# EAGLE design MRF49XA Breakout (EAGLE 6.4)
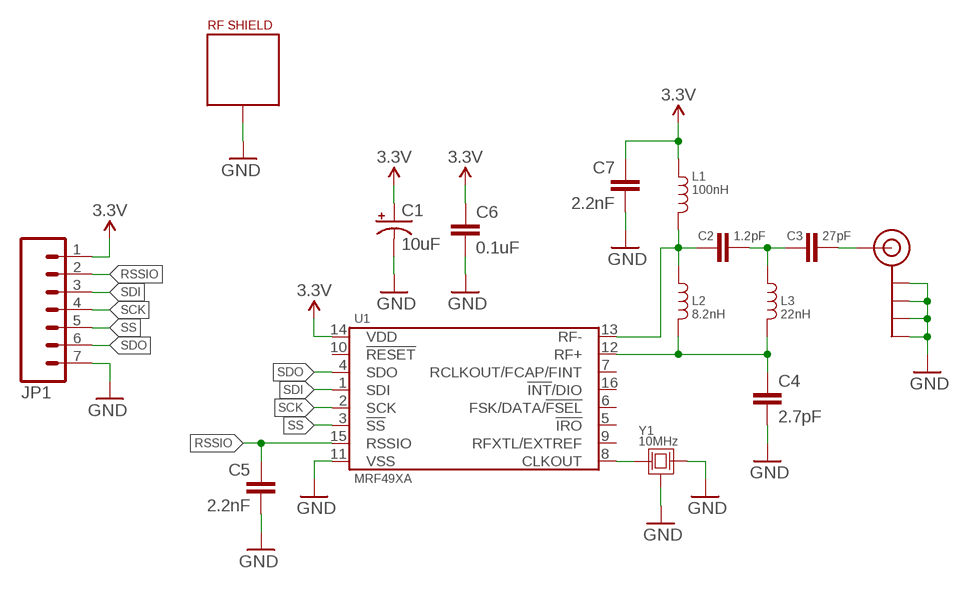
[diagram p0: schematic, sheet 1]

## Parts
C1  10uF  CAP_POL0805  [0805-CAP_POL]
C2  1.2pF  CAP0805  [0805]
C3  27pF  CAP0805  [0805]
C4  2.7pF  CAP0805  [0805]
C5  2.2nF  CAP0805  [0805]
C6  0.1uF  CAP0805  [0805]
C7  2.2nF  CAP0805  [0805]
J$1  SMA_EDGE  [SMA-EDGE]
JP1  M07  [1X07]
L1  100nH  INDUCTOR-0805  [0805]
L2  8.2nH  INDUCTOR-0805  [0805]
L3  22nH  INDUCTOR-0805  [0805]
U1  MRF49XA  [TSSOP-16]
U$1  RF-SHIELD  [RF_SHIELD-.65X.65]
Y1  10MHz  CRYSTAL-3.2X2.5  [FA-238]

## Nets
3.3V: C1.A(+) C6.1 C7.1 JP1.1 L1.1 U1.14(VDD)
GND: C1.C(-) C4.2 C5.2 C6.2 C7.2 J$1.GND@0(GND) J$1.GND@1(GND) J$1.GND@2(GND) J$1.GND@3(GND) JP1.7 U1.11(VSS) U$1.P$1 U$1.P$2 U$1.P$3 U$1.P$4 U$1.P$5 U$1.P$6 U$1.P$7 U$1.P$8 U$1.P$9 U$1.P$10 U$1.P$11 U$1.P$12 Y1.2(GND) Y1.3 Y1.4(GND)
N$1: C4.1 L2.2 L3.2 U1.12(RF+)
N$2: C2.1 L1.2 L2.1 U1.13(RF-)
N$3: C2.2 C3.1 L3.1
N$5: C3.2 J$1.SIG(SIGNAL)
N$12: U1.8(CLKOUT) Y1.1
RSSIO: C5.1 JP1.2 U1.15(RSSIO)
SCK: JP1.4 U1.2(SCK)
SDI: JP1.3 U1.1(SDI)
SDO: JP1.6 U1.4(SDO)
SS: JP1.5 U1.3(!SS)
Unconnected: U1.5(!IRO) U1.6(FSK/DATA/!FSEL) U1.7(RCLKOUT/FCAP/FINT) U1.9(RFXTL/EXTREF) U1.10(!RESET) U1.16(!INT!/DIO)

## Library data of the parts
C1 = SparkFun-Passives:CAP_POL: Capacitor Polarized These are standard SMD and PTH capacitors. Normally 10uF, 47uF, and 100uF in electrolytic and tantalum varieties. Always verify the external diameter of the through hole cap, it varies with capacity, voltage, and manufacturer. The EIA devices should be standard.
C2-C7 = SparkFun-Passives:CAP: Capacitor Standard 0603 ceramic capacitor, and 0.1" leaded capacitor.
J$1 = SparkFun-Connectors:SMA_EDGE: SMA Antenna Connector End launch SMA connector. The paste layer has been removed so that the connector can be hand soldered onto the board after reflow.
JP1 = SparkFun-Connectors:M07: Header 7 Standard 7-pin 0.1" header. Use with straight break away headers (SKU : PRT-00116), right angle break away headers (PRT-00553), swiss pins (PRT-00743), machine pins (PRT-00117), and female headers (PRT-00115). NOTES ON THE VARIANTS LOCK and LOCK_LONGPADS... This footprint was designed to help hold the alignment of a through-hole component (i.e. 7-pin header) while soldering it into place. You may notice that each hole has been shifted either up or down by 0.005 of an inch from it's more standard position (which is usually a perfectly straight line). This slight alteration caused the pins (the squares in the middle) to touch the edges of the holes. Because they are alternating, it causes a "brace" to hold the header in place. 0.005 has proven to be the perfect amount of "off-center" position when using our standard breakaway headers. Although looks a little odd when you look at the bare footprint, once you have a header in there, the alteration is very hard to notice. Also, if you push a header all the way into place, it is covered up entirely on the bottom side. This idea of altering the position of holes to aid alignment will be further integrated into the Sparkfun Library for other footprints. It can help hold any component with 3 or more connection pins.
L1-L3 = Passives:INDUCTOR
U1 = Microchip:MRF49XA
U$1 = Passives:RF-SHIELD
Y1 = Passives:CRYSTAL

## Net classes
1 rf: clearance 0.6 mm

## Board
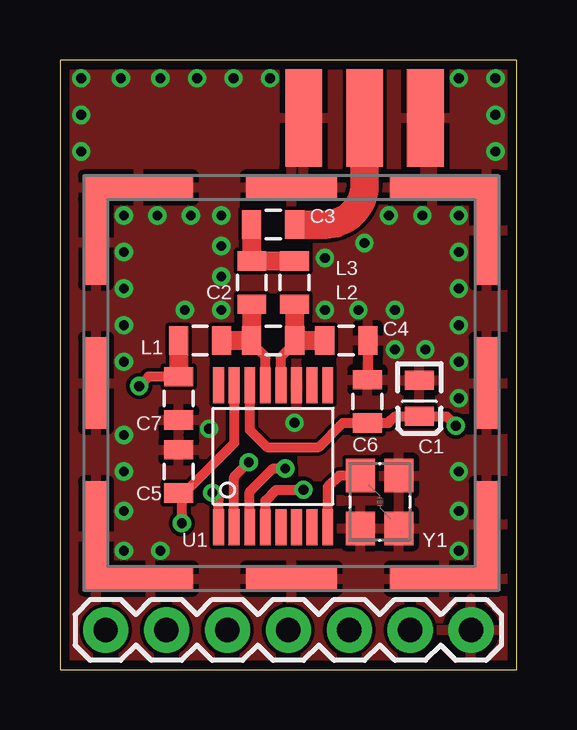
[diagram p1: board, top side]
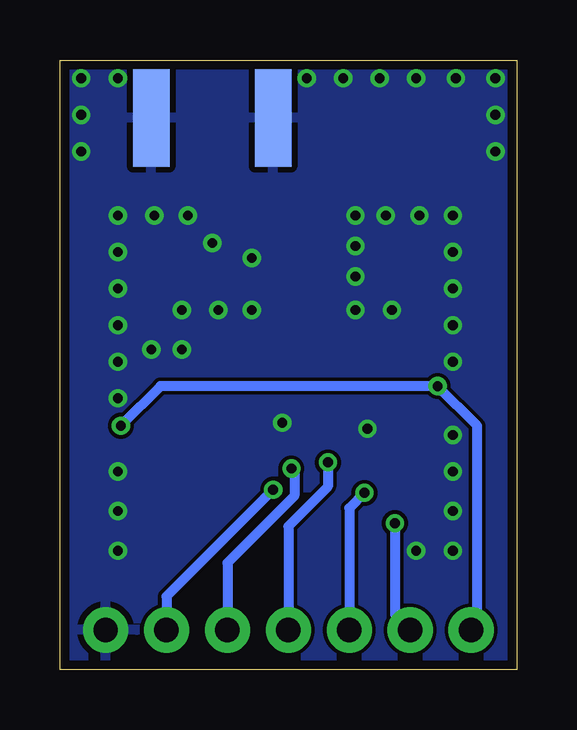
[diagram p2: board, bottom side, seen from below]

Size 19.05 x 25.4 mm. Coordinates in mm from the lower left corner, seen from the top.
Outline: 0,0 19.05,0 19.05,25.4 0,25.4 0,0
Copper layers (1*16): Top 0.0356mm / dielectric 1.5011mm / Bottom 0.0356mm
Design rules "LaenPCBOrder *": minimum track width 6mil, minimum drill 13mil, track to track 6mil, track to pad 6mil, pad to pad 6mil, via to via 6mil, smd to smd 6mil, copper to edge 15mil, drill to drill 6mil, minimum pad ring 7mil, minimum via ring 7mil, stop-mask expansion 4mil, vias tented up to drill 17mil, thermal gap 10mil

### Footprints (pad centres in the part's own frame; a part is rotated, then mirrored left to right if it is on the bottom)
0805-CAP_POL = smd 0.8 x 1.2: A 0.75,0; C -0.75,0
0805 = smd 0.8 x 1.2: 1 -0.9,0; 2 0.9,0
SMA-EDGE = smd 1.524 x 4.064: GND@0 0,0; GND@1 5.08,0; SIG 2.54,0 | smd 1.524 x 4.064 bottom: GND@2 0,0; GND@3 5.08,0
1X07 = drill 1.016 pad 1.88: 1 0,0; 2 2.54,0; 3 5.08,0; 4 7.62,0; 5 10.16,0; 6 12.7,0; 7 15.24,0
TSSOP-16 = smd 1.5 x 0.45: 1 -2.95,2.275; 2 -2.95,1.625; 3 -2.95,0.975; 4 -2.95,0.325; 5 -2.95,-0.325; 6 -2.95,-0.975; 7 -2.95,-1.625; 8 -2.95,-2.275; 9 2.95,-2.275; 10 2.95,-1.625; 11 2.95,-0.975; 12 2.95,-0.325; 13 2.95,0.325; 14 2.95,0.975; 15 2.95,1.625; 16 2.95,2.275
RF_SHIELD-.65X.65 = smd 1 x 4.55: P$1 -8.15,-6.375; P$3 8.15,6.375 | smd 4.55 x 1: P$2 -6.375,8.15; P$4 6.375,-8.15 | smd 1 x 3.8: P$5 -8.15,0; P$6 8.15,0 | smd 3.8 x 1: P$7 0,8.15; P$8 0,-8.15 | smd 1 x 3.55: P$9 -8.15,5.875; P$11 8.15,-5.875 | smd 3.55 x 1: P$10 -5.875,-8.15; P$12 5.875,8.15
FA-238 = smd 1.4 x 1.2: 1 -1.1,-0.8; 2 1.1,-0.8; 3 1.1,0.8; 4 -1.1,0.8

### Placement (x,y rotation side)
C1  14.99,11.3 270 top
C2  8,16.13 90 top
C3  8.89,18.54 0 top
C4  11.94,13.72 0 top
C5  4.95,8.26 90 top
C6  12.83,11.18 90 top
C7  4.95,11.3 270 top
J$1  10.16,22.99 0 top
JP1  1.91,1.65 0 top
L1  5.84,13.72 0 top
L2  8.89,13.72 0 top
L3  9.78,16.13 270 top
U1  8.89,8.89 90 top
U$1  9.65,11.94 0 top
Y1  13.34,6.99 270 top

### Tracks (layer width: path | path; a pad name or v marks a point on that pad's centre or on a via)
3.3V  (via drill 0.41)
  Top 0.406: U1.14 7.92,9.99 8.64,9.27 10.79,9.27 11.8,10.28 C6.1 13.71,10.28 13.98,10.55 C1.A 16.12,10.55 v16.51,10.16 | C7.1 3.69,12.2 v3.3,11.81
  Top 0.787: L1.1 4.94,12.21 C7.1
  Bottom 0.406: JP1.1 1.65,1.91 1.65,10.16 v3.3,11.81 14.86,11.81 v16.51,10.16
GND  (via drill 0.41)
  Top 0.406: C4.2 C6.2
  other vias: 9.78,10.29 6.22,10.03 13.97,13.34 13.97,14.99 11.05,14.99 18.16,24.64 18.16,23.11 6.73,14.99 6.73,16.38 5.46,18.92 8.76,24.64 7.24,24.64 5.71,24.64 4.19,24.64 2.54,24.64 0.89,24.64 0.89,23.11 6.73,18.92 2.67,18.92 2.67,17.4 2.67,15.88 2.67,14.35 4.19,4.95 2.67,4.95 2.67,8.26 2.67,6.6 6.73,17.65 0.89,21.59 18.16,21.59 2.67,12.83 2.67,9.78 13.72,18.92 12.7,17.78 16.64,18.92 15.11,18.92 16.64,17.4 16.64,15.88 16.64,14.35 12.45,14.99 16.64,12.83 16.64,11.3 16.64,4.95 16.64,8.26 16.64,6.6 11.05,17.14 15.24,13.34 5.21,14.99 4.06,18.92 16.64,24.64
  pour Top: -1.27,26.67 20.32,26.67 20.32,-1.27 -1.27,-1.27
  pour Bottom: -2.54,27.94 21.59,27.94 21.59,-2.54 -2.54,-2.54
N$1
  Top 0.406: U1.12 9.21,13.03 9.79,13.6 L2.2
  Top 0.787: L3.2 9.79,15.22 L2.2 C4.1
N$2
  Top 0.406: U1.13 8.56,13.03 7.99,13.6 L2.1
  Top 0.787: C2.1 7.99,15.22 L2.1 L1.2
N$3
  Top 0.787: C3.1 C2.2 L3.1
N$5
  Top 0.787: C3.2 10.03,18.54
  Top 1.194: J$1.SIG 12.7,20.19 arc-90 11.05,18.54 10.03,18.54
N$12
  Top 0.406: Y1.1 11.64,8.09 11.16,7.61 U1.8
RSSIO  (via drill 0.41)
  Top 0.406: U1.15 7.26,9.44 5.18,7.36 C5.1 5.08,7.24 v5.08,6.1
  Bottom 0.406: v5.08,6.1 5.08,2.29 JP1.2
SCK  (via drill 0.41)
  Top 0.406: U1.2 7.26,8.03 v7.87,8.64
  Bottom 0.406: v7.87,8.64 7.87,7.62 9.53,5.97 JP1.4
SDI  (via drill 0.41)
  Top 0.406: U1.1 6.62,7.1 v6.35,7.37
  Bottom 0.406: v6.35,7.37 6.99,6.73 JP1.3
SDO  (via drill 0.41)
  Top 0.406: U1.4 8.56,7.04 9.02,7.49 v10.16,7.49
  Bottom 0.406: v10.16,7.49 14.61,3.05 JP1.6
SS  (via drill 0.41)
  Top 0.406: U1.3 7.92,7.41 8.89,8.38 v9.4,8.38
  Bottom 0.406: v9.4,8.38 9.27,8.26 9.27,7.24 12.06,4.45 JP1.5